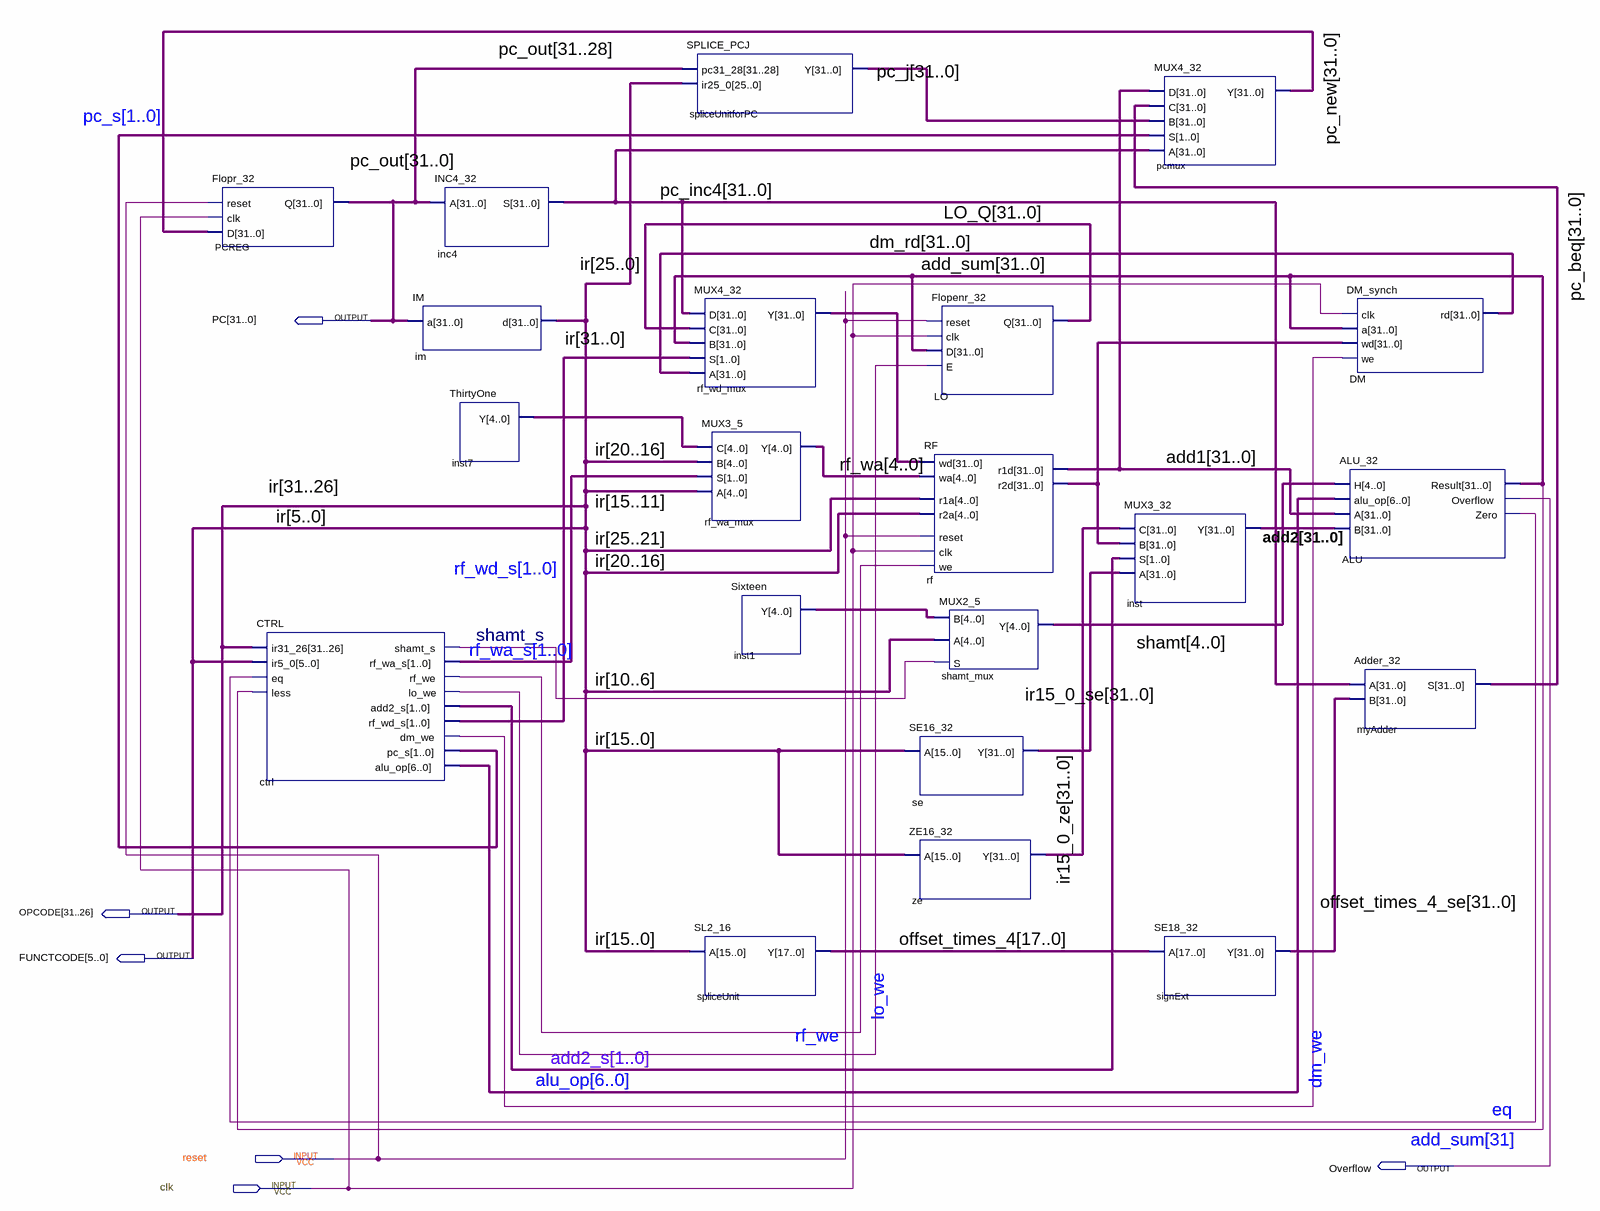
[diagram p0: schematic sheet]
// Quartus schematic CPU_SingleCycle.bdf as structural Verilog: 21 symbols, 6 pins
module CPU_SingleCycle (
  input  reset,
  input  clk,
  output [31:0] PC,
  output [31:26] OPCODE,
  output [5:0] FUNCTCODE,
  output Overflow
);

  wire dm_we, eq, lo_we, rf_we, shamt_s;
  wire [1:0] add2_s, pc_s, rf_wa_s, rf_wd_s;
  wire [4:0] inst1_y, inst7_y, rf_wa, shamt;
  wire [6:0] alu_op;
  wire [17:0] offset_times_4;
  wire [25:6] ir;
  wire [31:0] add1, add2, add_sum, dm_rd, ir15_0_se, ir15_0_ze, LO_Q, offset_times_4_se, pc_beq, pc_inc4,
       pc_j, pc_new, rf_r2d, rf_wd_mux_y;

  Flopr_32 PCREG (.reset(reset), .clk(clk), .D(pc_new), .Q(PC));
  CTRL ctrl (
    .ir31_26(OPCODE), .ir5_0(FUNCTCODE), .eq(eq), .less(add_sum[31]), .shamt_s(shamt_s), .rf_wa_s(rf_wa_s),
    .rf_we(rf_we), .lo_we(lo_we), .add2_s(add2_s), .rf_wd_s(rf_wd_s), .dm_we(dm_we), .pc_s(pc_s),
    .alu_op(alu_op));
  IM im (.a(PC), .d({OPCODE, ir, FUNCTCODE}));
  INC4_32 inc4 (.A(PC), .S(pc_inc4));
  ThirtyOne inst7 (.Y(inst7_y));
  SPLICE_PCJ spliceUnitforPC (.pc31_28(PC[31:28]), .ir25_0({ir, FUNCTCODE}), .Y(pc_j));
  MUX4_32 rf_wd_mux (.D(pc_inc4), .C(LO_Q), .B(add_sum), .S(rf_wd_s), .A(dm_rd), .Y(rf_wd_mux_y));
  MUX3_5 rf_wa_mux (.C(inst7_y), .B(ir[20:16]), .S(rf_wa_s), .A(ir[15:11]), .Y(rf_wa));
  SL2_16 spliceUnit (.A({ir[15:6], FUNCTCODE}), .Y(offset_times_4));
  Sixteen inst1 (.Y(inst1_y));
  Flopenr_32 LO (.reset(reset), .clk(clk), .D(add_sum), .E(lo_we), .Q(LO_Q));
  RF rf (
    .r1a(ir[25:21]), .r2a(ir[20:16]), .reset(reset), .clk(clk), .wd(rf_wd_mux_y), .we(rf_we), .wa(rf_wa),
    .r1d(add1), .r2d(rf_r2d));
  MUX2_5 shamt_mux (.S(shamt_s), .A(ir[10:6]), .B(inst1_y), .Y(shamt));
  SE16_32 se (.A({ir[15:6], FUNCTCODE}), .Y(ir15_0_se));
  ZE16_32 ze (.A({ir[15:6], FUNCTCODE}), .Y(ir15_0_ze));
  MUX3_32 inst (.C(ir15_0_ze), .B(rf_r2d), .S(add2_s), .A(ir15_0_se), .Y(add2));
  MUX4_32 pcmux (.D(add1), .C(pc_beq), .B(pc_j), .S(pc_s), .A(pc_inc4), .Y(pc_new));
  SE18_32 signExt (.A(offset_times_4), .Y(offset_times_4_se));
  DM_synch DM (.clk(clk), .a(add_sum), .wd(rf_r2d), .we(dm_we), .rd(dm_rd));
  ALU_32 ALU (.H(shamt), .alu_op(alu_op), .A(add1), .B(add2), .Result(add_sum), .Overflow(Overflow), .Zero(eq));
  Adder_32 myAdder (.A(pc_inc4), .B(offset_times_4_se), .S(pc_beq));

  // Other names for the same wires on the sheet: ir (some bits) = {OPCODE, FUNCTCODE}; pc_out[31:0] = PC
endmodule
